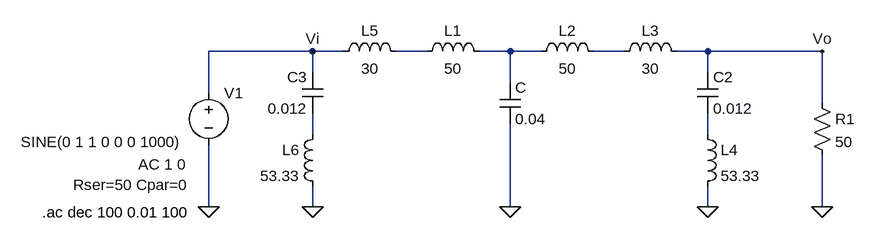
[diagram p0: schematic celda_m_t.asc]
celda_m_t.asc, the LTspice schematic file:
Version 4
SHEET 1 880 680
WIRE -16 128 -176 128
WIRE 32 128 -16 128
WIRE 160 128 112 128
WIRE 288 128 240 128
WIRE 336 128 288 128
WIRE 464 128 416 128
WIRE 592 128 544 128
WIRE 768 128 592 128
WIRE -16 160 -16 128
WIRE 592 160 592 128
WIRE 288 176 288 128
WIRE -176 192 -176 128
WIRE 768 208 768 128
WIRE -16 256 -16 224
WIRE 592 256 592 224
WIRE -176 368 -176 272
WIRE -16 368 -16 336
WIRE 288 368 288 240
WIRE 592 368 592 336
WIRE 768 368 768 288
FLAG 288 368 0
FLAG 592 368 0
FLAG -16 368 0
FLAG 768 368 0
FLAG -176 368 0
FLAG 768 128 Vo
FLAG -16 128 Vi
SYMBOL ind 144 144 R270
WINDOW 0 32 56 VTop 2
WINDOW 3 5 56 VBottom 2
SYMATTR InstName L1
SYMATTR Value 50
SYMBOL ind 320 144 R270
WINDOW 0 32 56 VTop 2
WINDOW 3 5 56 VBottom 2
SYMATTR InstName L2
SYMATTR Value 50
SYMBOL cap 272 176 R0
SYMATTR InstName C
SYMATTR Value 0.04
SYMBOL ind 448 144 R270
WINDOW 0 32 56 VTop 2
WINDOW 3 5 56 VBottom 2
SYMATTR InstName L3
SYMATTR Value 30
SYMBOL cap 576 160 R0
SYMATTR InstName C2
SYMATTR Value 0.012
SYMBOL ind 576 240 R0
SYMATTR InstName L4
SYMATTR Value 53.33
SYMBOL ind 128 144 M270
WINDOW 0 32 56 VTop 2
WINDOW 3 5 56 VBottom 2
SYMATTR InstName L5
SYMATTR Value 30
SYMBOL cap 0 160 M0
SYMATTR InstName C3
SYMATTR Value 0.012
SYMBOL ind 0 240 M0
SYMATTR InstName L6
SYMATTR Value 53.33
SYMBOL res 752 192 R0
SYMATTR InstName R1
SYMATTR Value 50
SYMBOL voltage -176 176 R0
WINDOW 3 -289 92 Left 2
WINDOW 123 -108 126 Left 2
WINDOW 39 -208 158 Left 2
SYMATTR InstName V1
SYMATTR Value SINE(0 1 1 0 0 0 1000)
SYMATTR Value2 AC 1 0
SYMATTR SpiceLine Rser=50 Cpar=0
TEXT -432 376 Left 2 !.ac dec 100 0.01 100

The netlist it stands for:
* celda_m_t.asc
L1 N001 N002 50
L2 N002 N003 50
C N002 0 0.04
L3 N003 Vo 30
C2 Vo N005 0.012
L4 N005 0 53.33
L5 N001 Vi 30
C3 Vi N004 0.012
L6 N004 0 53.33
R1 Vo 0 50
V1 Vi 0 SINE(0 1 1 0 0 0 1000) AC 1 0 Rser=50 Cpar=0
.ac dec 100 0.01 100
.backanno
.end